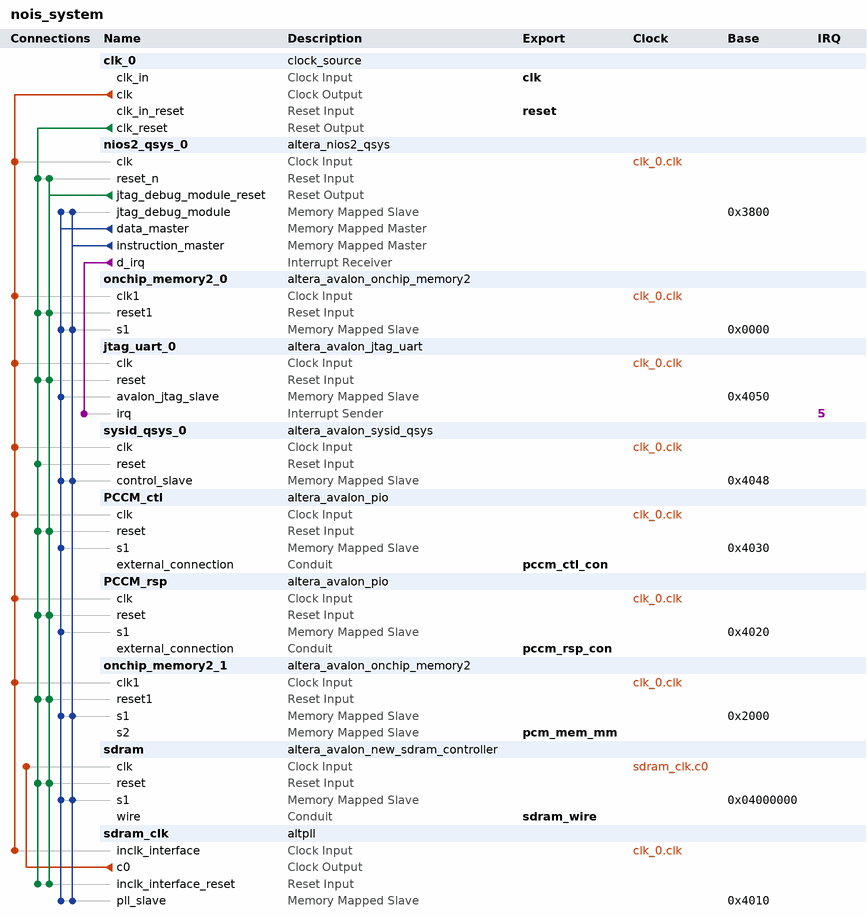
[diagram p0: system contents]
# Platform Designer (Qsys) system nois_system, Cyclone IV E EP4CE115F29C7
# Parameters at their usual value, and those the tool derives, are not listed.
package require -exact qsys 14.0
create_system nois_system
set_project_property DEVICE_FAMILY {Cyclone IV E}
set_project_property DEVICE EP4CE115F29C7

add_instance clk_0 clock_source 14.0
set_instance_parameter_value clk_0 clockFrequency 50000000

add_instance nios2_qsys_0 altera_nios2_qsys 14.0
set_instance_parameter_value nios2_qsys_0 resetrequest_enabled true
set_instance_parameter_value nios2_qsys_0 resetSlave sdram.s1
set_instance_parameter_value nios2_qsys_0 mmu_TLBMissExcSlave None
set_instance_parameter_value nios2_qsys_0 exceptionSlave sdram.s1
set_instance_parameter_value nios2_qsys_0 breakSlave nios2_qsys_0.jtag_debug_module
set_instance_parameter_value nios2_qsys_0 impl Tiny
set_instance_parameter_value nios2_qsys_0 icache_size 4096

add_instance onchip_memory2_0 altera_avalon_onchip_memory2 14.0
set_instance_parameter_value onchip_memory2_0 dataWidth 32
set_instance_parameter_value onchip_memory2_0 dualPort false
set_instance_parameter_value onchip_memory2_0 initMemContent true
set_instance_parameter_value onchip_memory2_0 initializationFileName onchip_mem.hex
set_instance_parameter_value onchip_memory2_0 memorySize 4096

add_instance jtag_uart_0 altera_avalon_jtag_uart 14.0
set_instance_parameter_value jtag_uart_0 simInteractiveOptions NO_INTERACTIVE_WINDOWS

add_instance sysid_qsys_0 altera_avalon_sysid_qsys 14.0
set_instance_parameter_value sysid_qsys_0 id 0

add_instance PCCM_ctl altera_avalon_pio 14.0
set_instance_parameter_value PCCM_ctl direction Output
set_instance_parameter_value PCCM_ctl width 4

add_instance PCCM_rsp altera_avalon_pio 14.0
set_instance_parameter_value PCCM_rsp direction Input
set_instance_parameter_value PCCM_rsp width 4

add_instance onchip_memory2_1 altera_avalon_onchip_memory2 14.0
set_instance_parameter_value onchip_memory2_1 dataWidth 16
set_instance_parameter_value onchip_memory2_1 dualPort true
set_instance_parameter_value onchip_memory2_1 initMemContent true
set_instance_parameter_value onchip_memory2_1 initializationFileName onchip_mem.hex
set_instance_parameter_value onchip_memory2_1 memorySize 4096
set_instance_parameter_value onchip_memory2_1 singleClockOperation true

add_instance sdram altera_avalon_new_sdram_controller 14.0
set_instance_parameter_value sdram TAC 5.5
set_instance_parameter_value sdram TRCD 20.0
set_instance_parameter_value sdram TRP 20.0
set_instance_parameter_value sdram casLatency 3
set_instance_parameter_value sdram columnWidth 8
set_instance_parameter_value sdram dataWidth 32
set_instance_parameter_value sdram generateSimulationModel false
set_instance_parameter_value sdram model single_Micron_MT48LC4M32B2_7_chip
set_instance_parameter_value sdram numberOfBanks 4
set_instance_parameter_value sdram numberOfChipSelects 1
set_instance_parameter_value sdram powerUpDelay 200.0
set_instance_parameter_value sdram refreshPeriod 7.8125
set_instance_parameter_value sdram rowWidth 13

add_instance sdram_clk altpll 14.0
set_instance_parameter_value sdram_clk INCLK0_INPUT_FREQUENCY 20000
set_instance_parameter_value sdram_clk CLK0_MULTIPLY_BY 1
set_instance_parameter_value sdram_clk CLK0_DIVIDE_BY 1
set_instance_parameter_value sdram_clk CLK0_PHASE_SHIFT -3000
set_instance_parameter_value sdram_clk PORT_clk1 PORT_UNUSED
set_instance_parameter_value sdram_clk PORT_clk2 PORT_UNUSED
set_instance_parameter_value sdram_clk PORT_clk3 PORT_UNUSED
set_instance_parameter_value sdram_clk PORT_ARESET PORT_UNUSED
set_instance_parameter_value sdram_clk PORT_LOCKED PORT_UNUSED

# connections
add_connection clk_0.clk jtag_uart_0.clk clock
add_connection clk_0.clk nios2_qsys_0.clk clock
add_connection clk_0.clk onchip_memory2_0.clk1 clock
add_connection clk_0.clk onchip_memory2_1.clk1 clock
add_connection clk_0.clk PCCM_ctl.clk clock
add_connection clk_0.clk PCCM_rsp.clk clock
add_connection clk_0.clk sdram_clk.inclk_interface clock
add_connection clk_0.clk sysid_qsys_0.clk clock
add_connection sdram_clk.c0 sdram.clk clock
add_connection clk_0.clk_reset jtag_uart_0.reset reset
add_connection clk_0.clk_reset nios2_qsys_0.reset_n reset
add_connection clk_0.clk_reset onchip_memory2_0.reset1 reset
add_connection clk_0.clk_reset onchip_memory2_1.reset1 reset
add_connection clk_0.clk_reset PCCM_ctl.reset reset
add_connection clk_0.clk_reset PCCM_rsp.reset reset
add_connection clk_0.clk_reset sdram.reset reset
add_connection clk_0.clk_reset sdram_clk.inclk_interface_reset reset
add_connection clk_0.clk_reset sysid_qsys_0.reset reset
add_connection nios2_qsys_0.jtag_debug_module_reset jtag_uart_0.reset reset
add_connection nios2_qsys_0.jtag_debug_module_reset nios2_qsys_0.reset_n reset
add_connection nios2_qsys_0.jtag_debug_module_reset onchip_memory2_0.reset1 reset
add_connection nios2_qsys_0.jtag_debug_module_reset onchip_memory2_1.reset1 reset
add_connection nios2_qsys_0.jtag_debug_module_reset PCCM_ctl.reset reset
add_connection nios2_qsys_0.jtag_debug_module_reset PCCM_rsp.reset reset
add_connection nios2_qsys_0.jtag_debug_module_reset sdram.reset reset
add_connection nios2_qsys_0.jtag_debug_module_reset sdram_clk.inclk_interface_reset reset
add_connection nios2_qsys_0.data_master jtag_uart_0.avalon_jtag_slave avalon
set_connection_parameter_value nios2_qsys_0.data_master/jtag_uart_0.avalon_jtag_slave baseAddress 0x4050
add_connection nios2_qsys_0.data_master nios2_qsys_0.jtag_debug_module avalon
set_connection_parameter_value nios2_qsys_0.data_master/nios2_qsys_0.jtag_debug_module baseAddress 0x3800
add_connection nios2_qsys_0.data_master onchip_memory2_0.s1 avalon
set_connection_parameter_value nios2_qsys_0.data_master/onchip_memory2_0.s1 baseAddress 0x0000
add_connection nios2_qsys_0.data_master onchip_memory2_1.s1 avalon
set_connection_parameter_value nios2_qsys_0.data_master/onchip_memory2_1.s1 baseAddress 0x2000
add_connection nios2_qsys_0.data_master PCCM_ctl.s1 avalon
set_connection_parameter_value nios2_qsys_0.data_master/PCCM_ctl.s1 baseAddress 0x4030
add_connection nios2_qsys_0.data_master PCCM_rsp.s1 avalon
set_connection_parameter_value nios2_qsys_0.data_master/PCCM_rsp.s1 baseAddress 0x4020
add_connection nios2_qsys_0.data_master sdram.s1 avalon
set_connection_parameter_value nios2_qsys_0.data_master/sdram.s1 baseAddress 0x04000000
add_connection nios2_qsys_0.data_master sdram_clk.pll_slave avalon
set_connection_parameter_value nios2_qsys_0.data_master/sdram_clk.pll_slave baseAddress 0x4010
add_connection nios2_qsys_0.data_master sysid_qsys_0.control_slave avalon
set_connection_parameter_value nios2_qsys_0.data_master/sysid_qsys_0.control_slave baseAddress 0x4048
add_connection nios2_qsys_0.instruction_master nios2_qsys_0.jtag_debug_module avalon
set_connection_parameter_value nios2_qsys_0.instruction_master/nios2_qsys_0.jtag_debug_module baseAddress 0x3800
add_connection nios2_qsys_0.instruction_master onchip_memory2_0.s1 avalon
set_connection_parameter_value nios2_qsys_0.instruction_master/onchip_memory2_0.s1 baseAddress 0x0000
add_connection nios2_qsys_0.instruction_master onchip_memory2_1.s1 avalon
set_connection_parameter_value nios2_qsys_0.instruction_master/onchip_memory2_1.s1 baseAddress 0x2000
add_connection nios2_qsys_0.instruction_master sdram.s1 avalon
set_connection_parameter_value nios2_qsys_0.instruction_master/sdram.s1 baseAddress 0x04000000
add_connection nios2_qsys_0.instruction_master sdram_clk.pll_slave avalon
set_connection_parameter_value nios2_qsys_0.instruction_master/sdram_clk.pll_slave baseAddress 0x4010
add_connection nios2_qsys_0.instruction_master sysid_qsys_0.control_slave avalon
set_connection_parameter_value nios2_qsys_0.instruction_master/sysid_qsys_0.control_slave baseAddress 0x4048
add_connection nios2_qsys_0.d_irq jtag_uart_0.irq interrupt
set_connection_parameter_value nios2_qsys_0.d_irq/jtag_uart_0.irq irqNumber 5

# exported interfaces
add_interface clk clock sink
set_interface_property clk EXPORT_OF clk_0.clk_in
add_interface reset reset sink
set_interface_property reset EXPORT_OF clk_0.clk_in_reset
add_interface pccm_ctl_con conduit end
set_interface_property pccm_ctl_con EXPORT_OF PCCM_ctl.external_connection
add_interface pccm_rsp_con conduit end
set_interface_property pccm_rsp_con EXPORT_OF PCCM_rsp.external_connection
add_interface pcm_mem_mm avalon slave
set_interface_property pcm_mem_mm EXPORT_OF onchip_memory2_1.s2
add_interface sdram_wire conduit end
set_interface_property sdram_wire EXPORT_OF sdram.wire

set_interconnect_requirement {$system} qsys_mm.clockCrossingAdapter HANDSHAKE
set_interconnect_requirement {$system} qsys_mm.maxAdditionalLatency 1
set_interconnect_requirement {$system} qsys_mm.insertDefaultSlave FALSE

save_system nois_system.qsys
